# Altium schematic sheet Sheet5.SCHDOC
size 840 x 594 mm; SheetNumber: 5; SheetTotal: 5; DocumentName: Sheet5.SCHDOC
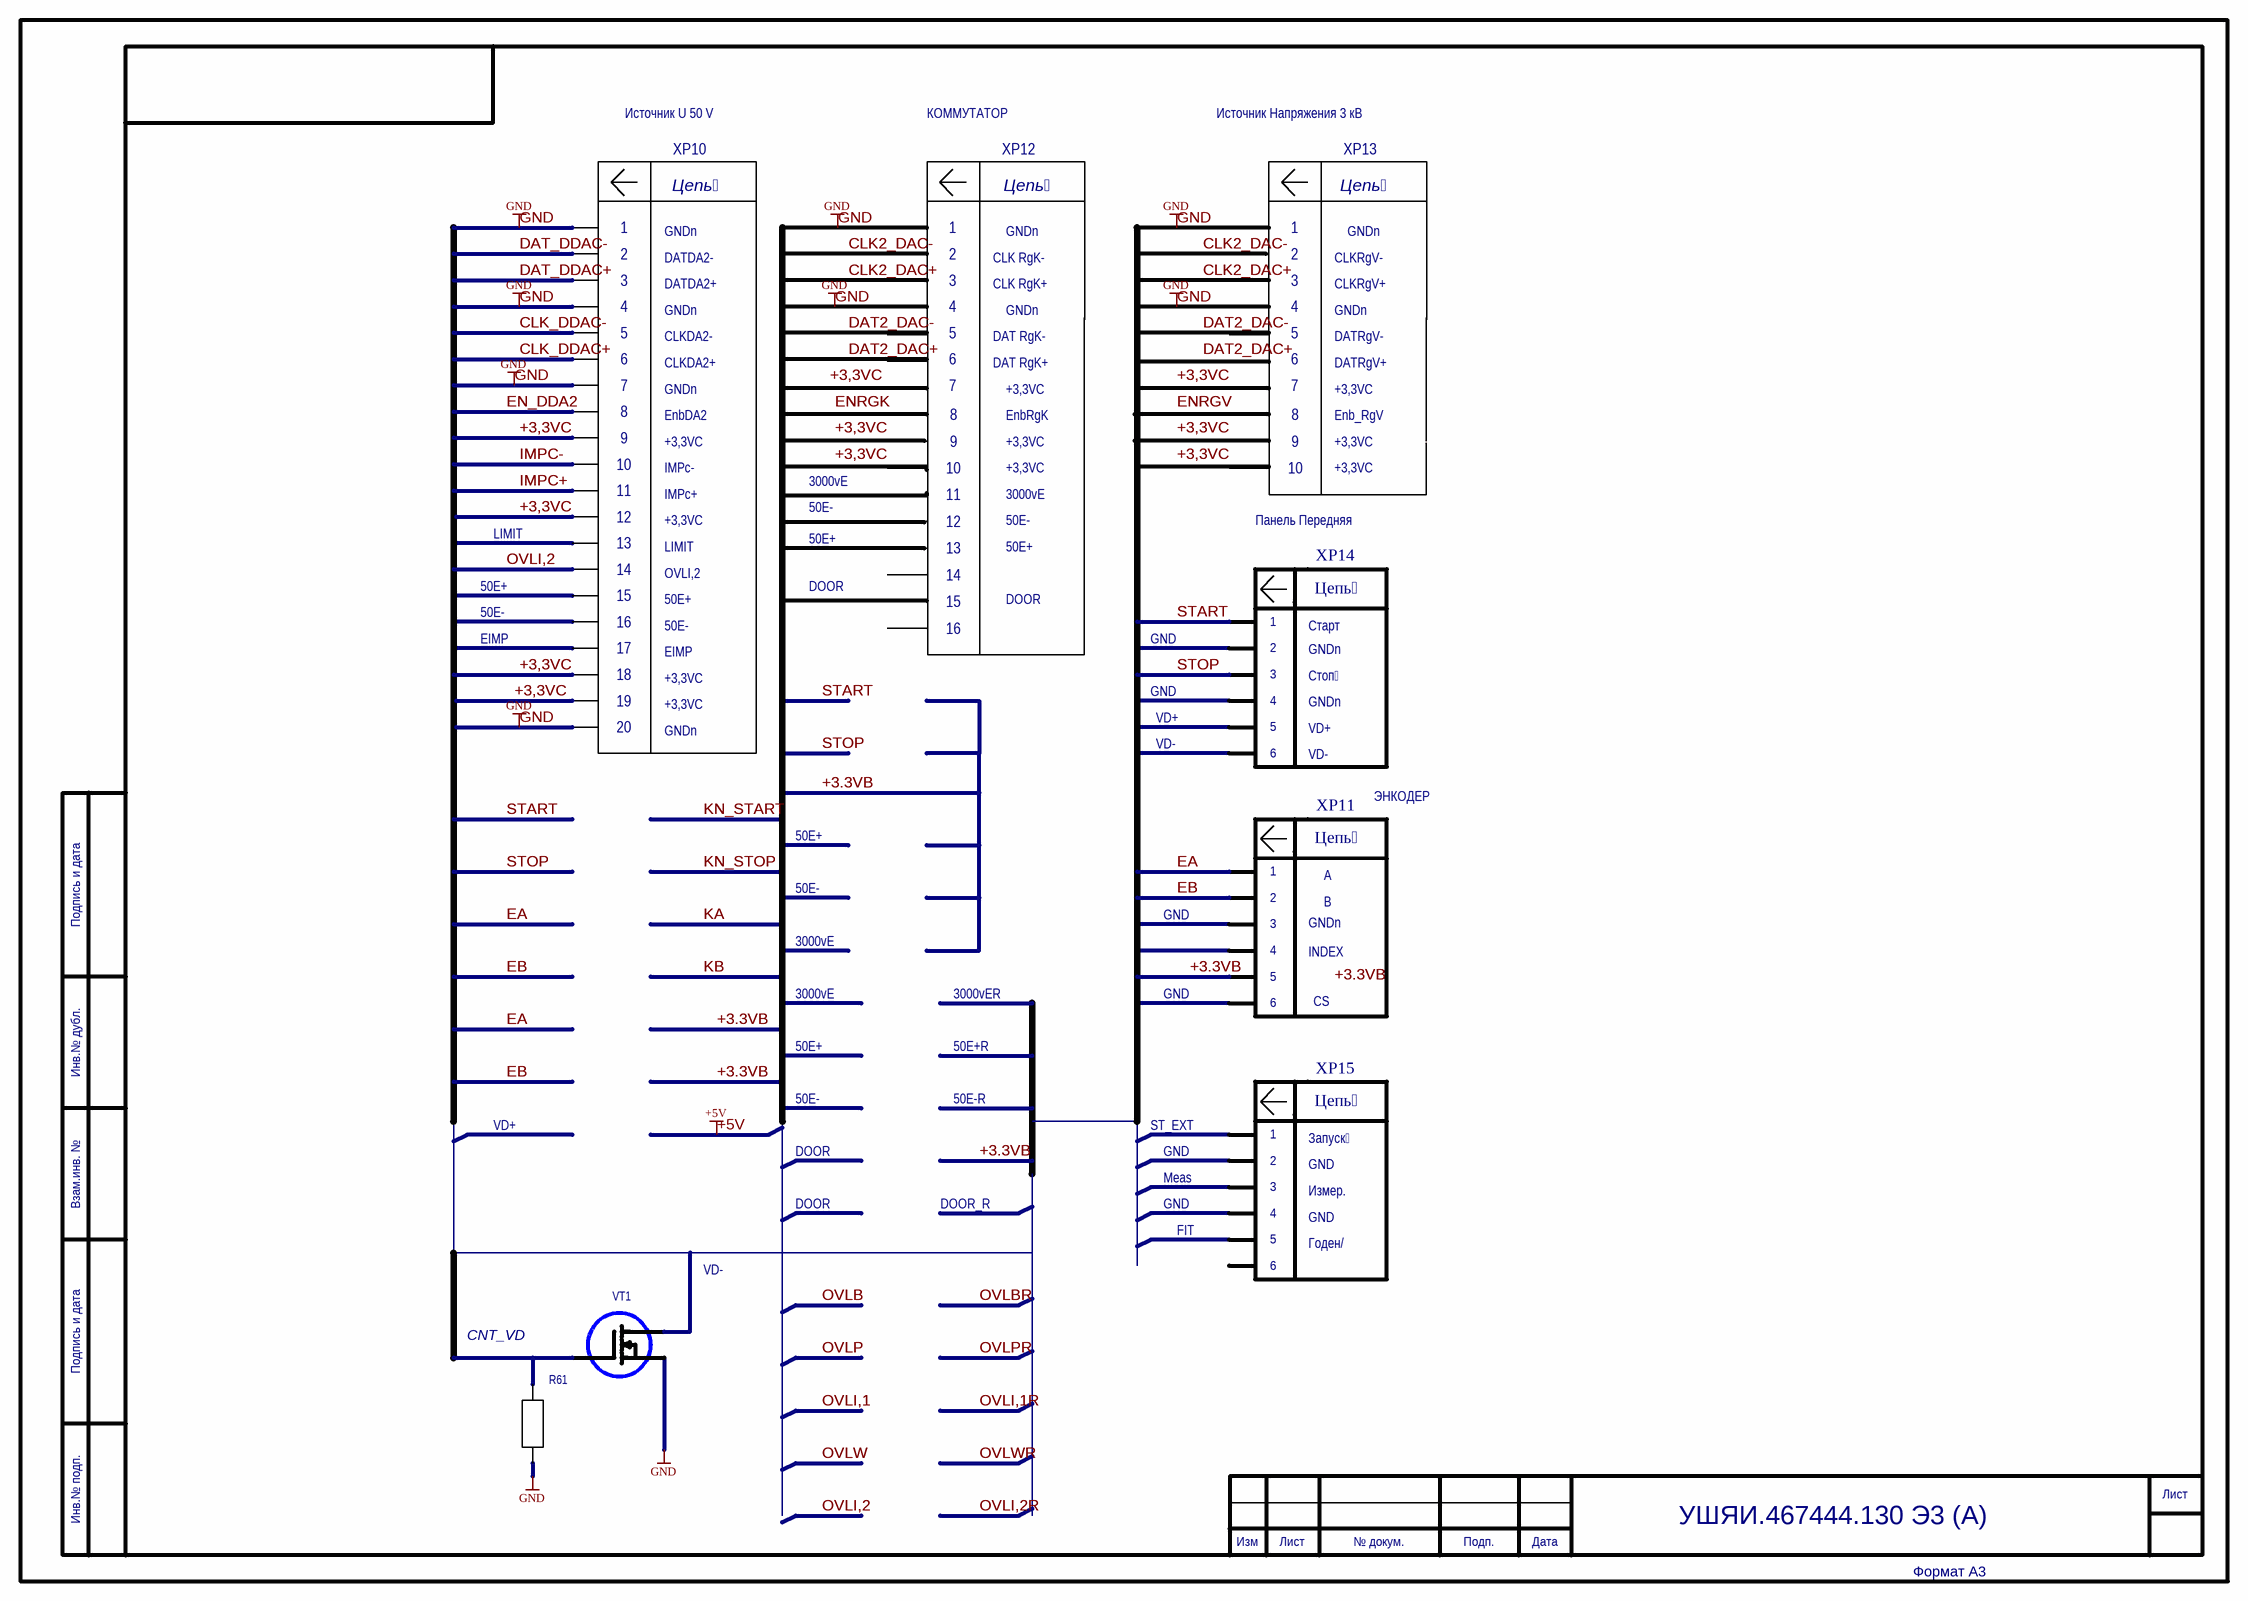
[diagram p0: Sheet5.SCHDOC]

## Parts
R61  1206-10 КОМ+-5%  (value not drawn)
VT1  NDS7002A  (value not drawn)
XP10  BH-20-A  (value not drawn)
XP11  AMP II 280372-2  (value not drawn)
XP12  BH-20-16  (value not drawn)
XP13  BH-20-10  (value not drawn)
XP14  AMP II 280372-2  (value not drawn)
XP15  AMP II 280372-2  (value not drawn)

## Nets
GND: R61.1 VT1.2 XP10.1 XP10.4 XP10.7 XP10.20
+3,3VC: XP10.9 XP10.12 XP10.18 XP10.19
+3.3VB: XP11.5
CLK_DDAC+: XP10.6
CLK_DDAC-: XP10.5
DAT_DDAC+: XP10.3
DAT_DDAC-: XP10.2
EA: XP11.1
EB: XP11.2
EN_DDA2: XP10.8
IMPC+: XP10.11
IMPC-: XP10.10
OVLI,2: XP10.14
START: XP14.1
STOP: XP14.3
NetR61_2: R61.2 VT1.1

Not connected (* = marked no-connect by the designer): VT1 3(2); XP10 13 15 16 17; XP11 3 4 6; XP12 21(0) 22(1) 23(2) 24(3) 25(4) 26(5) 27(6) 28(7) 29(0) 30(1) 31(2) 32(3) 33(4) 34(5) 35(6) 36(7); XP13 21(0) 22(1) 23(2) 24(3) 25(4) 26(5) 27(6) 28(7) 29(0) 30(1); XP14 2 4 5 6; XP15 1 2 3 4 5 6

## Notes on the sheet
- Источник U 50 V
- КОММУТАТОР
- Источник Напряжения 3 кВ
- GNDn
- Цепь
- DATDA2+
- DATDA2-
- CLK RgK+
- CLK RgK-
- CLKRgV+
- CLKRgV-
- CLKDA2+
- CLKDA2-
- DAT RgK+
- DAT RgK-
- DATRgV+
- DATRgV-
- EnbDA2
- EnbRgK
- +3,3VC
- Enb_RgV
- IMPc-
- IMPc+
- 3000vE
- LIMIT
- OVLI,2
- 50E+
- 50E-
- (near XP13) Панель Передняя
- EIMP
- DOOR
- GND
- (near XP14) Старт
- (near XP14) Стоп
- (near XP14) GNDn
- VD+
- VD-
- (near XP14) VD-
- (near XP14) VD+
- ЭНКОДЕР
- Подпись и дата
- A
- B
- (near XP11) GNDn
- (near XP11) INDEX
- Инв.№ дубл.
- 3000vER
- CS
- 50E+R
- 50E-R
- Взам.инв. №
- ST_EXT
- (near XP15) GND
- (near XP15) Запуск
- DOOR_R
- Meas
- FIT
- (near XP15) Измер.
- (near XP15) Годен/
- CNT_VD
- Инв.№ подп.
- УШЯИ.467444.130 Э3 (A)
- Лист
- Изм
- № докум.
- Подп.
- Дата
- Формат А3
- Подп. дата
- Инв. № дубл.
- Взам. инв. №
- Подп. и дата
- Инв. № подл.
- Изм.
- ALTIUM GOSTBOM2.0 KEV
- Файл:
- Копировал
- (in symbol AMP II 280372-2) Цепь
- (in symbol BH-20-10) 8; 9; 10
- (in symbol BH-20-16) 8; 9; 10; 11; 12; 13; 14; 15; 16

## Library data of the parts
R61 = 1206-10 КОМ+-5%: Name1: Резистор 1206-10 кОм+-5%; Value: *; Name2: Резистор 1206-10 кОм+-5%
VT1 = NDS7002A: Name2: Транзистор NDS7002A; Standart: FAIRCHILD Semiconductor; Value: *; Name1: Транзистор NDS7002A
XP10 = BH-20-A: Standart: Белконтмаш; Name2: Вилка BH-20; Name1: Вилка BH-20 Белконтмаш; Value: *
XP11 XP14 XP15 = AMP II 280372-2: Standart: ELFA (43-834-28); Name2: Вилка AMP II-280372-2 Tyco Electronics; Value: *; Name1: Вилка AMP II-280372-2 Tyco Electronics
XP12 = BH-20-16: Name2: Вилка BH-20-8; Name1: Вилка BH-20 Белконтмаш; Standart: Белконтмаш; Value: *
XP13 = BH-20-10: Name2: Вилка BH-20-8; Name1: Вилка BH-20 Белконтмаш; Standart: Белконтмаш; Value: *